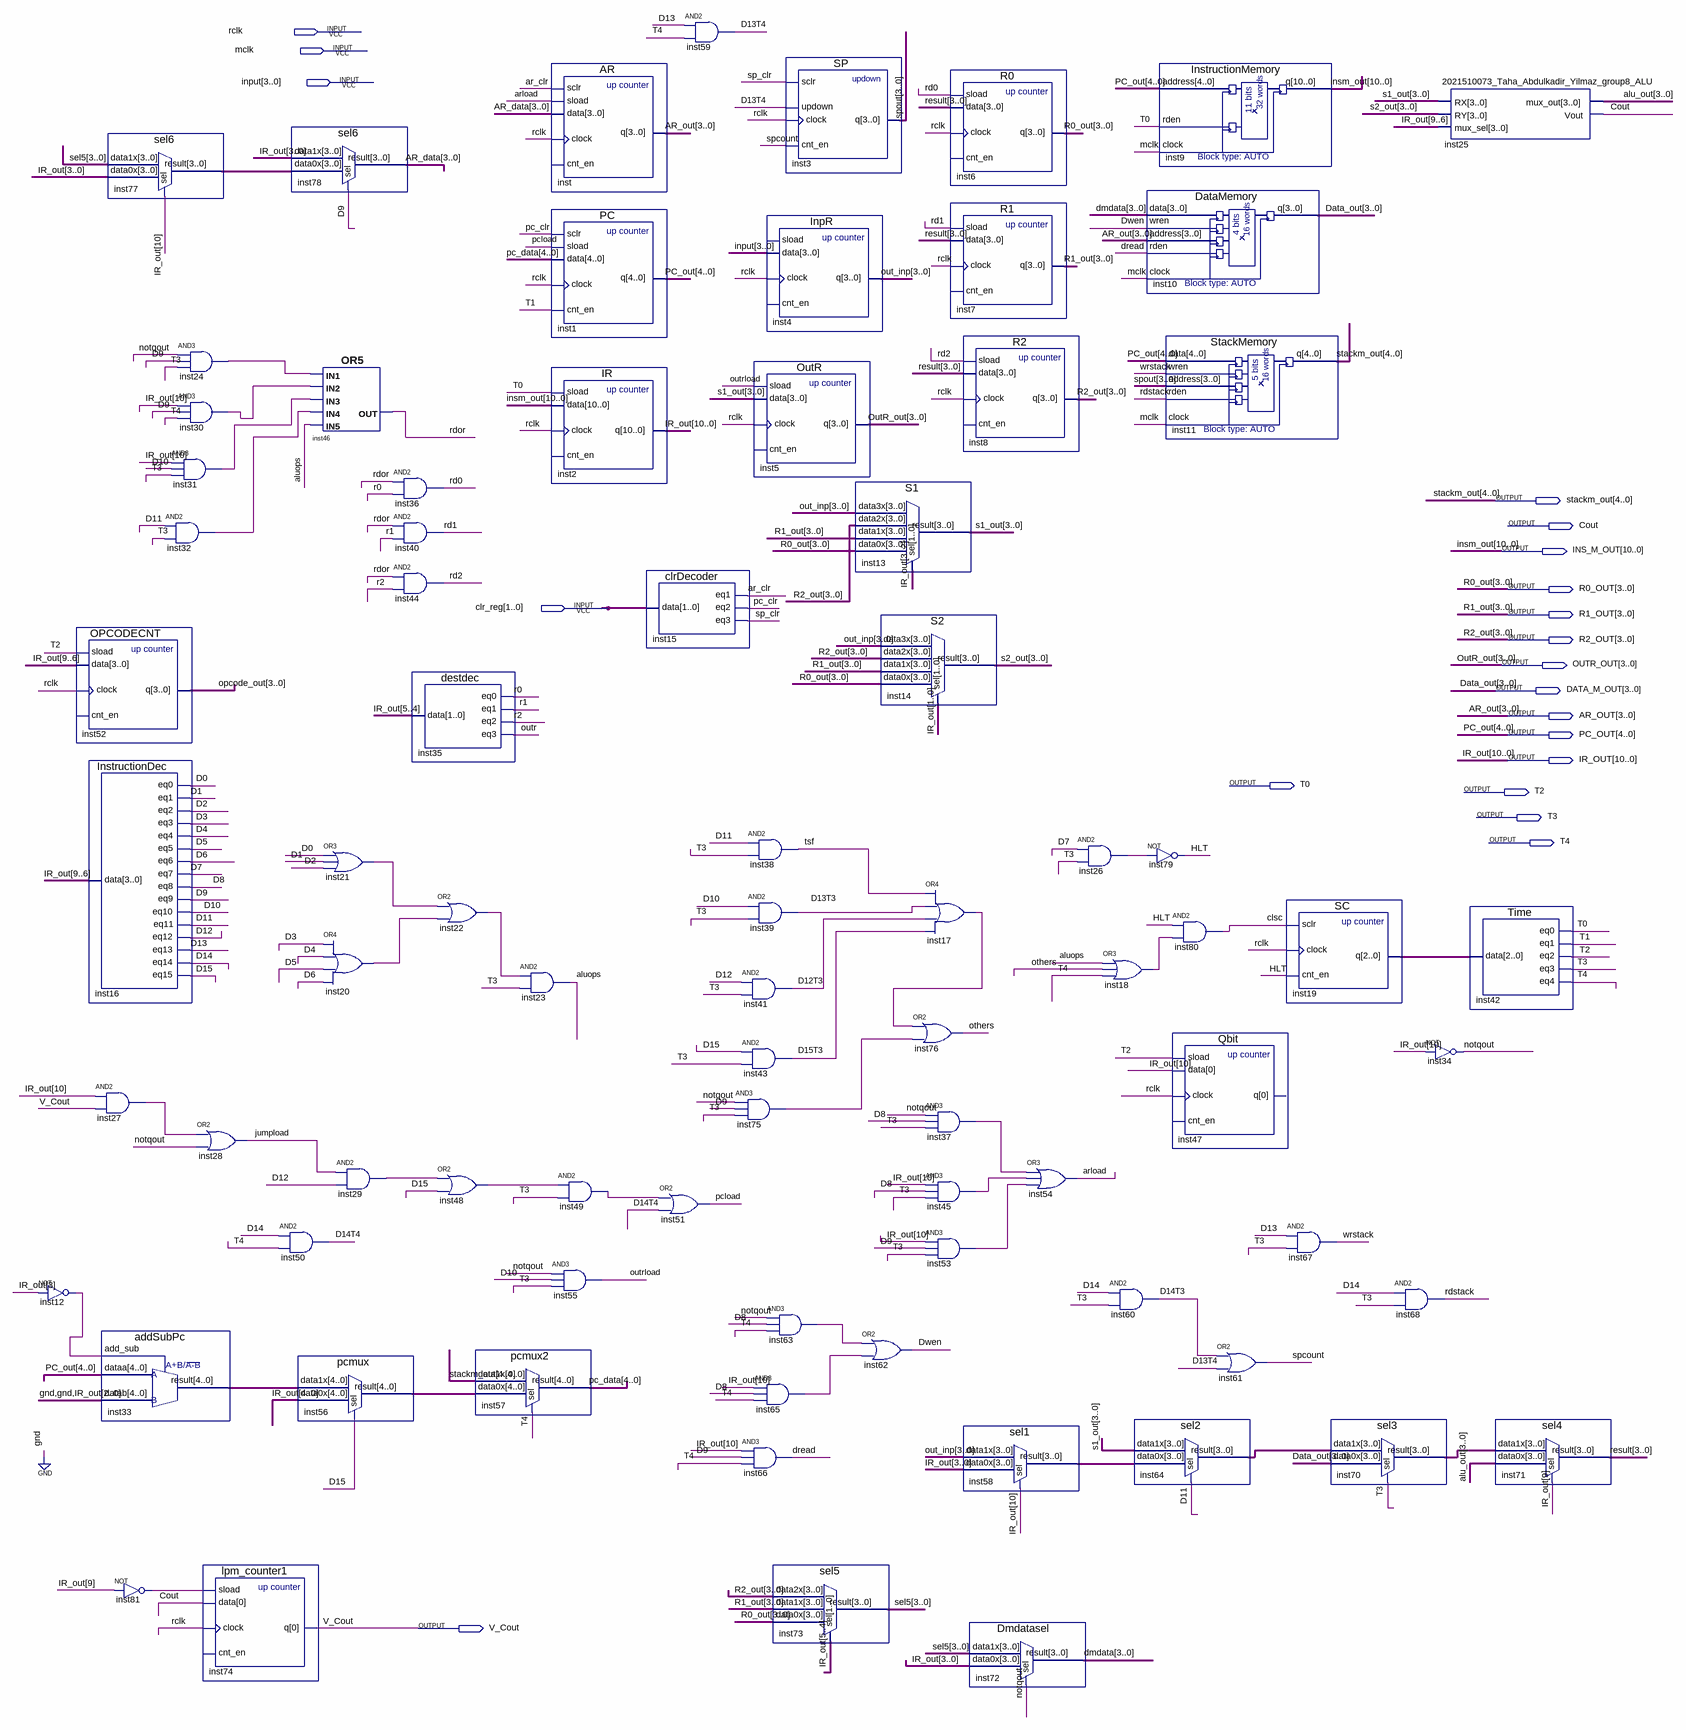
[diagram p0: schematic sheet]
// Quartus schematic 3.bdf as structural Verilog: 81 symbols, 20 pins
module \3  (
  input  rclk,
  input  mclk,
  input  [3:0] \input ,
  input  [1:0] clr_reg,
  output [4:0] stackm_out,
  output Cout,
  output [10:0] INS_M_OUT,
  output [3:0] R0_OUT,
  output [3:0] R1_OUT,
  output [3:0] R2_OUT,
  output [3:0] OUTR_OUT,
  output [3:0] DATA_M_OUT,
  output [3:0] AR_OUT,
  output [4:0] PC_OUT,
  output [10:0] IR_OUT,
  output T0,
  output T2,
  output T3,
  output T4,
  output V_Cout
);

  wire aluops, ar_clr, arload, clsc, D0, D1, D2, D3, D4, D5, D6, D7, D8, D9, D10, D11, D12, D12T3, D13,
       D13T3, D13T4, D14, D14T3, D14T4, D15, D15T3, dread, Dwen, HLT, inst12_out, inst17_out, inst18_out,
       inst20_out, inst21_out, inst22_out, inst24_out, inst26_out, inst27_out, inst29_out, inst30_out,
       inst31_out, inst32_out, inst37_out, inst45_out, inst48_out, inst49_out, inst53_out, inst63_out,
       inst65_out, inst75_out, inst81_out, jumpload, notqout, others, outr, outrload, pc_clr, pcload, r0, r1,
       r2, rd0, rd1, rd2, rdor, rdstack, sp_clr, spcount, T1, tsf, wrstack;
  wire [2:0] inst19_q;
  wire [3:0] alu_out, AR_data, dmdata, inst58_result, inst64_result, inst70_result, inst77_result,
       opcode_out, out_inp, result, s1_out, s2_out, sel5, spout;
  wire [4:0] inst33_result, inst56_result, pc_data;

  OPCODECNT inst52 (.sload(T2), .data(IR_OUT[9:6]), .clock(rclk), .q(opcode_out));  // open: cnt_en
  not inst12 (inst12_out, IR_OUT[3]);
  sel6 inst77 (.data1x(sel5), .data0x(IR_OUT[3:0]), .sel(IR_OUT[10]), .result(inst77_result));
  InstructionDec inst16 (
    .data(IR_OUT[9:6]), .eq0(D0), .eq1(D1), .eq2(D2), .eq3(D3), .eq4(D4), .eq5(D5), .eq6(D6), .eq7(D7),
    .eq8(D8), .eq9(D9), .eq10(D10), .eq11(D11), .eq12(D12), .eq13(D13), .eq14(D14), .eq15(D15));
  and inst27 (inst27_out, IR_OUT[10], V_Cout);
  addSubPc inst33 (.add_sub(inst12_out), .dataa(PC_OUT), .datab({2'b00, IR_OUT[2:0]}), .result(inst33_result));
  not inst81 (inst81_out, IR_OUT[9]);
  and inst24 (inst24_out, notqout, D9, T3);
  and inst30 (inst30_out, IR_OUT[10], D9, T4);
  and inst31 (inst31_out, IR_OUT[10], D10, T3);
  and inst32 (inst32_out, D11, T3);
  or inst28 (jumpload, inst27_out, notqout);
  lpm_counter1 inst74 (.sload(inst81_out), .data(Cout), .clock(rclk), .q(V_Cout));  // open: cnt_en
  and inst50 (D14T4, D14, T4);
  sel6 inst78 (.data1x(IR_OUT[3:0]), .data0x(inst77_result), .sel(D9), .result(AR_data));
  or inst46 (rdor, inst24_out, inst30_out, inst31_out, inst32_out, aluops);
  or inst21 (inst21_out, D0, D1, D2);
  or inst20 (inst20_out, D3, D4, D5, D6);
  pcmux inst56 (.data1x(inst33_result), .data0x(IR_OUT[4:0]), .sel(D15), .result(inst56_result));
  and inst29 (inst29_out, jumpload, D12);
  and inst36 (rd0, rdor, r0);
  and inst40 (rd1, rdor, r1);
  and inst44 (rd2, rdor, r2);
  destdec inst35 (.data(IR_OUT[5:4]), .eq0(r0), .eq1(r1), .eq2(r2), .eq3(outr));
  or inst22 (inst22_out, inst21_out, inst20_out);
  or inst48 (inst48_out, inst29_out, D15);
  pcmux2 inst57 (.data1x(stackm_out), .data0x(inst56_result), .sel(T4), .result(pc_data));
  and inst23 (aluops, inst22_out, T3);
  AR inst (.sclr(ar_clr), .sload(arload), .data(AR_data), .clock(rclk), .q(AR_OUT));  // open: cnt_en
  PC inst1 (.sclr(pc_clr), .sload(pcload), .data(pc_data), .clock(rclk), .cnt_en(T1), .q(PC_OUT));
  IR inst2 (.sload(T0), .data(INS_M_OUT), .clock(rclk), .q(IR_OUT));  // open: cnt_en
  and inst49 (inst49_out, inst48_out, T3);
  and inst55 (outrload, notqout, D10, T3);
  and inst59 (D13T4, D13, T4);
  clrDecoder inst15 (.data(clr_reg), .eq1(ar_clr), .eq2(pc_clr), .eq3(sp_clr));
  or inst51 (pcload, inst49_out, D14T4);
  and inst75 (inst75_out, notqout, D9, T3);
  SP inst3 (.sclr(sp_clr), .updown(D13T4), .clock(rclk), .cnt_en(spcount), .q(spout));
  InpR inst4 (.data(\input ), .clock(rclk), .q(out_inp));  // open: sload, cnt_en
  OutR inst5 (.sload(outrload), .data(s1_out), .clock(rclk), .q(OUTR_OUT));  // open: cnt_en
  and inst38 (tsf, D11, T3);
  and inst39 (D13T3, D10, T3);
  and inst41 (D12T3, D12, T3);
  and inst43 (D15T3, D15, T3);
  and inst63 (inst63_out, notqout, D8, T4);
  and inst65 (inst65_out, IR_OUT[10], D8, T4);
  and inst66 (dread, IR_OUT[10], D9, T4);
  sel5 inst73 (.data2x(R2_OUT), .data1x(R1_OUT), .data0x(R0_OUT), .sel(IR_OUT[5:4]), .result(sel5));
  S1 inst13 (.data3x(out_inp), .data2x(R2_OUT), .data1x(R1_OUT), .data0x(R0_OUT), .sel(IR_OUT[3:2]), .result(s1_out));
  S2 inst14 (.data3x(out_inp), .data2x(R2_OUT), .data1x(R1_OUT), .data0x(R0_OUT), .sel(IR_OUT[1:0]), .result(s2_out));
  or inst62 (Dwen, inst63_out, inst65_out);
  or inst17 (inst17_out, tsf, D13T3, D12T3, D15T3);
  or inst76 (others, inst17_out, inst75_out);
  and inst37 (inst37_out, notqout, D8, T3);
  and inst45 (inst45_out, IR_OUT[10], D8, T3);
  and inst53 (inst53_out, IR_OUT[10], D9, T3);
  R0 inst6 (.sload(rd0), .data(result), .clock(rclk), .q(R0_OUT));  // open: cnt_en
  R1 inst7 (.sload(rd1), .data(result), .clock(rclk), .q(R1_OUT));  // open: cnt_en
  R2 inst8 (.sload(rd2), .data(result), .clock(rclk), .q(R2_OUT));  // open: cnt_en
  sel1 inst58 (.data1x(out_inp), .data0x(IR_OUT[3:0]), .sel(IR_OUT[10]), .result(inst58_result));
  Dmdatasel inst72 (.data1x(sel5), .data0x(IR_OUT[3:0]), .sel(notqout), .result(dmdata));
  or inst54 (arload, inst37_out, inst45_out, inst53_out);
  and inst26 (inst26_out, D7, T3);
  or inst18 (inst18_out, aluops, others, T4);
  and inst60 (D14T3, D14, T3);
  sel2 inst64 (.data1x(s1_out), .data0x(inst58_result), .sel(D11), .result(inst64_result));
  InstructionMemory inst9 (.address(PC_OUT), .rden(T0), .clock(mclk), .q(INS_M_OUT));
  DataMemory inst10 (.data(dmdata), .wren(Dwen), .address(AR_OUT), .rden(dread), .clock(mclk), .q(DATA_M_OUT));
  StackMemory inst11 (.data(PC_OUT), .wren(wrstack), .address(spout), .rden(rdstack), .clock(mclk), .q(stackm_out));
  not inst79 (HLT, inst26_out);
  and inst80 (clsc, HLT, inst18_out);
  Qbit inst47 (.sload(T2), .data(IR_OUT[10]), .clock(rclk));  // open: cnt_en, q
  or inst61 (spcount, D14T3, D13T4);
  SC inst19 (.sclr(clsc), .clock(rclk), .cnt_en(HLT), .q(inst19_q));
  and inst67 (wrstack, D13, T3);
  sel3 inst70 (.data1x(inst64_result), .data0x(DATA_M_OUT), .sel(T3), .result(inst70_result));
  and inst68 (rdstack, D14, T3);
  \2021510073_Taha_Abdulkadir_Yilmaz_group8_ALU  inst25 (
    .RX(s1_out), .RY(s2_out), .mux_sel(IR_OUT[9:6]), .mux_out(alu_out), .Vout(Cout));
  not inst34 (notqout, IR_OUT[10]);
  Time inst42 (.data(inst19_q), .eq0(T0), .eq1(T1), .eq2(T2), .eq3(T3), .eq4(T4));
  sel4 inst71 (.data1x(inst70_result), .data0x(alu_out), .sel(IR_OUT[9]), .result(result));

  // Other names for the same wires on the sheet: Data_out[3:0] = DATA_M_OUT; insm_out[10:0] = INS_M_OUT
endmodule
